# EasyEDA schematic SCH_RC2014-Rotary-Encoder_2024-11-08.json
TITLE: Rotary Encoder for RC2014; REV: 1.3; Date: 2024-10-21; Sheet: 1/1; Drawn By: robert.price; Company: Robert Price
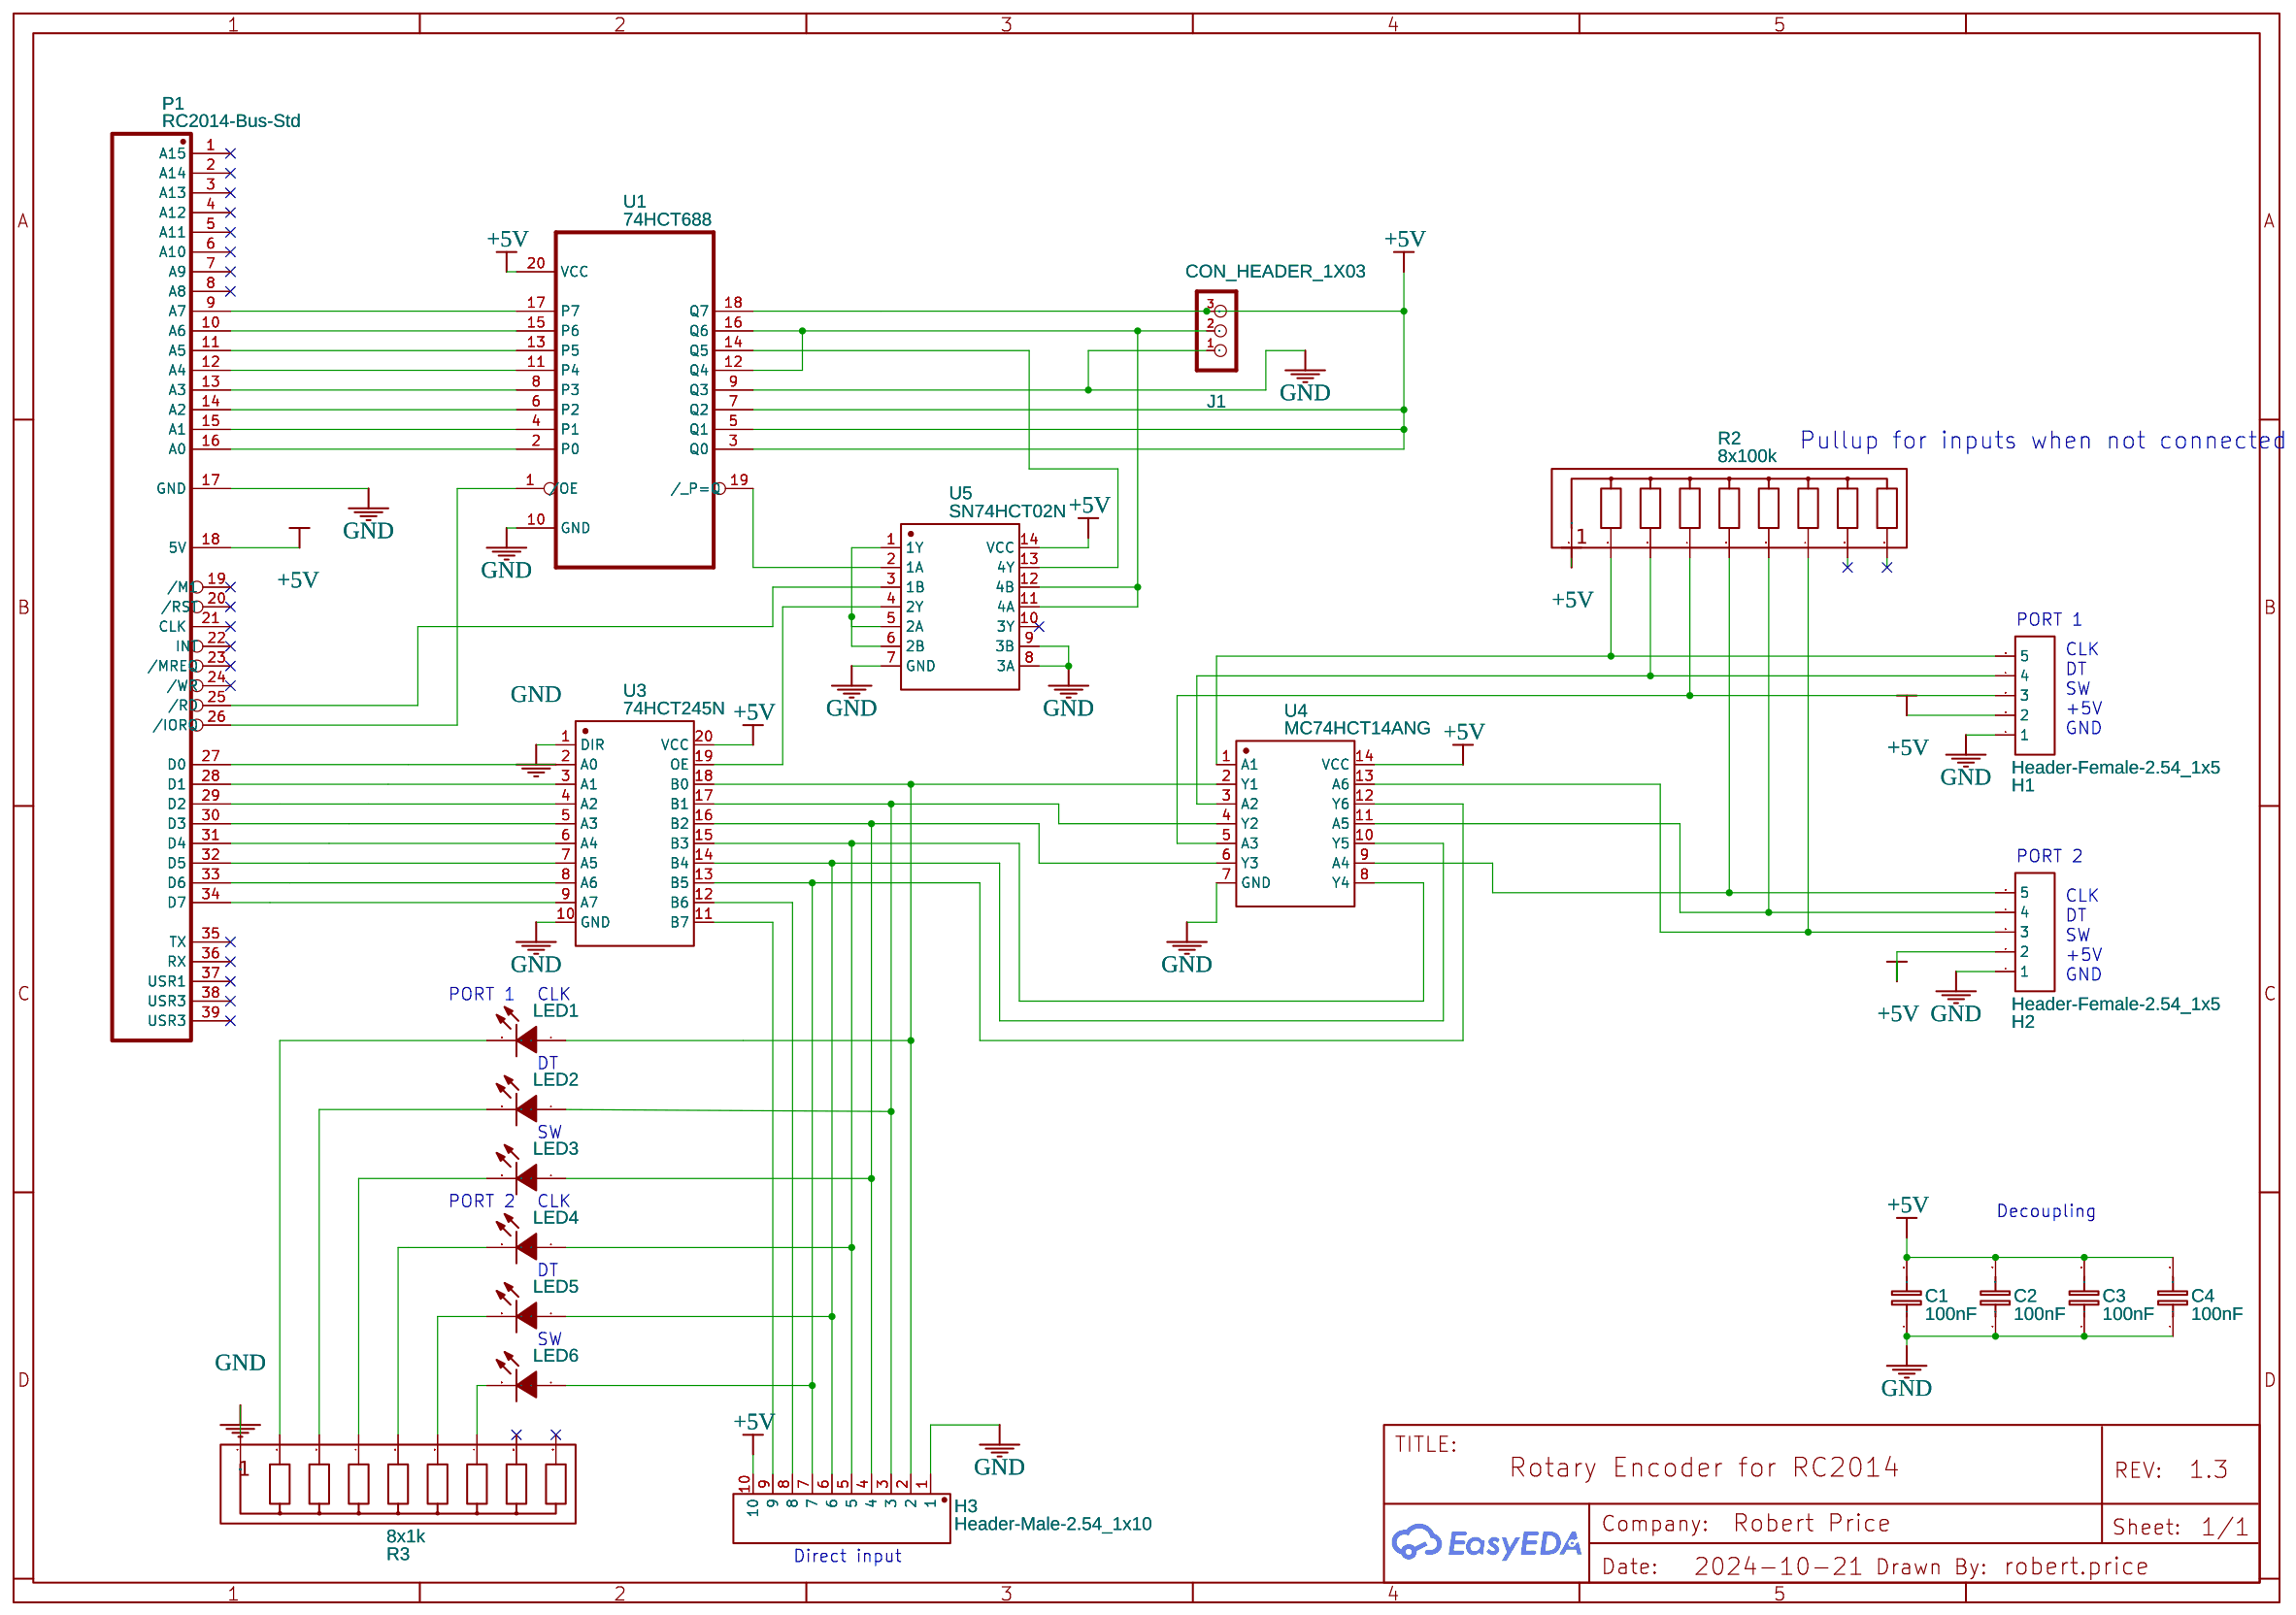
[diagram p0: schematic sheet]

## Parts
C1  100nF  [CAP-TH_L4.8-W3.2-P5.08-D0.5]
C2  100nF  [CAP-TH_L4.8-W3.2-P5.08-D0.5]
C3  100nF  [CAP-TH_L4.8-W3.2-P5.08-D0.5]
C4  100nF  [CAP-TH_L4.8-W3.2-P5.08-D0.5]
H1  Header-Female-2.54_1x5  [HDR-TH_5P-P2.54-V-F]
H2  Header-Female-2.54_1x5  [HDR-TH_5P-P2.54-V-F]
H3  Header-Male-2.54_1x10  [HDR-TH_10P-P2.54-V-M-1]
J1  CON_HEADER_1X03  [M1X3]
LED1  3ARB9HCB  [LED-3MM]
LED2  3ARB9HCB  [LED-3MM]
LED3  3ARB9HCB  [LED-3MM]
LED4  3ARB9HCB  [LED-3MM]
LED5  3ARB9HCB  [LED-3MM]
LED6  3ARB9HCB  [LED-3MM]
P1  RC2014-Bus-Std  [RC2014BUS-1X39-AMR-1]
R2  8x100k  [RESISTOR_ARRAY_BUSSED_8_RESISTORS]
R3  8x1k  [RESISTOR_ARRAY_BUSSED_8_RESISTORS]
U1  74HCT688  [PDIP-20]
U3  74HCT245N  [DIP20]
U4  MC74HCT14ANG  [DIP14]
U5  SN74HCT02N  [DIP14]

## Library data of the parts
C1-C4 = C_0603_EU: Contributor: LCEDA_Lib
H1 H2 = Header-Female-2.54_1x5: Supplier: LCSC; Manufacturer: BOOMELE(博穆精密); Manufacturer Part: 2.54-1*5P母; Supplier Part: C50950; JLCPCB Part Class: Extended Part
H3 = Header-Male-2.54_1x10: Supplier: LCSC; Manufacturer Part: 2.54-1*10P针; Supplier Part: C57369; JLCPCB Part Class: Extended Part; Manufacturer: BOOMELE(博穆精密)
J1 = CON_HEADER_1X03: Contributor: DangerousPrototype
LED1-LED6 = 3ARB9HCB: Supplier: LCSC; Manufacturer: KENTO; Supplier Part: C42016
P1 = RC2014-Bus-Std: Contributor: HansN
R2 R3 = RESISTOR-8xArrayBussed_SIL_EN60617-4_Derived04-01-01_Date20100615: Contributor: KiCAD; license: https://www.gnu.org/licenses/lgpl-2.1.html; Package Display: No
U1 = 74HCT688: 8-bit magnitude comparator; Contributor: sccousins; Supplier Part: 595-CD74HCT688E; Supplier: Mouser
U3 = 74HCT245N
U4 = MC74HCT14ANG
U5 = SN74HCT02N

## Nets
+5V: C1.2 C2.2 C3.2 C4.2 H1.2 H2.2 H3.10 J1.3 P1.18(5V) R2.1(Com) U1.3(Q0) U1.5(Q1) U1.7(Q2) U1.18(Q7) U1.20(VCC) U3.20(VCC) U4.14(VCC) U5.14(VCC)
GND: C1.1 C2.1 C3.1 C4.1 H1.1 H2.1 H3.1 J1.1 P1.17(GND) R3.1(Com) U1.9(Q3) U1.10(GND) U3.1(DIR) U3.10(GND) U4.7(GND) U5.7(GND) U5.8(3A) U5.9(3B)
Net-(H1-3): H1.3 R2.4 U4.5(A3)
Net-(H1-4): H1.4 R2.3 U4.3(A2)
Net-(H1-5): H1.5 R2.2 U4.1(A1)
Net-(H2-3): H2.3 R2.7 U4.13(A6)
Net-(H2-4): H2.4 R2.6 U4.11(A5)
Net-(H2-5): H2.5 R2.5 U4.9(A4)
Net-(H3-2): H3.2 LED1.1(A) U3.18(B0) U4.2(Y1)
Net-(H3-3): H3.3 LED2.1(A) U3.17(B1) U4.4(Y2)
Net-(H3-4): H3.4 LED3.1(A) U3.16(B2) U4.6(Y3)
Net-(H3-5): H3.5 LED4.1(A) U3.15(B3) U4.8(Y4)
Net-(H3-6): H3.6 LED5.1(A) U3.14(B4) U4.10(Y5)
Net-(H3-7): H3.7 LED6.1(A) U3.13(B5) U4.12(Y6)
Net-(H3-8): H3.8 U3.12(B6)
Net-(H3-9): H3.9 U3.11(B7)
Net-(J1-2): J1.2 U1.12(Q4) U1.16(Q6) U5.11(4A) U5.12(4B)
Net-(LED1-2): LED1.2(K) R3.2
Net-(LED2-2): LED2.2(K) R3.3
Net-(LED3-2): LED3.2(K) R3.4
Net-(LED4-2): LED4.2(K) R3.5
Net-(LED5-2): LED5.2(K) R3.6
Net-(LED6-2): LED6.2(K) R3.7
Net-(P1-9): P1.9(A7) U1.17(P7)
Net-(P1-10): P1.10(A6) U1.15(P6)
Net-(P1-11): P1.11(A5) U1.13(P5)
Net-(P1-12): P1.12(A4) U1.11(P4)
Net-(P1-13): P1.13(A3) U1.8(P3)
Net-(P1-14): P1.14(A2) U1.6(P2)
Net-(P1-15): P1.15(A1) U1.4(P1)
Net-(P1-16): P1.16(A0) U1.2(P0)
Net-(P1-25): P1.25(/RD) U5.3(1B)
Net-(P1-26): P1.26(/IORQ) U1.1(/OE)
Net-(P1-27): P1.27(D0) U3.2(A0)
Net-(P1-28): P1.28(D1) U3.3(A1)
Net-(P1-29): P1.29(D2) U3.4(A2)
Net-(P1-30): P1.30(D3) U3.5(A3)
Net-(P1-31): P1.31(D4) U3.6(A4)
Net-(P1-32): P1.32(D5) U3.7(A5)
Net-(P1-33): P1.33(D6) U3.8(A6)
Net-(P1-34): P1.34(D7) U3.9(A7)
Net-(U1-14): U1.14(Q5) U5.13(4Y)
Net-(U1-19): U1.19(/ P=Q) U5.2(1A)
Net-(U3-19): U3.19(OE) U5.4(2Y)
Net-(U5-1): U5.1(1Y) U5.5(2A) U5.6(2B)

Not connected (* = marked no-connect by the designer): P1 1(A15)* 2(A14)* 3(A13)* 4(A12)* 5(A11)* 6(A10)* 7(A9)* 8(A8)* 19(/M1)* 20(/RST)* 21(CLK)* 22(INT)* 23(/MREQ)* 24(/WR)* 35(TX)* 36(RX)* 37(USR1)* 38(USR3)* 39(USR3)*; R2 8 9; R3 8* 9*; U5 10(3Y)*

## Notes on the sheet
- Pullup for inputs when not connected
- PORT 1
- CLK
- DT
- SW
- +5V
- GND
- PORT 2
- CLK
- DT
- SW
- +5V
- GND
- PORT 1
- CLK
- DT
- SW
- PORT 2
- CLK
- Decoupling
- DT
- SW
- Direct input
